# Altium schematic sheet Mod_Igloo_v1.SchDoc
size A4
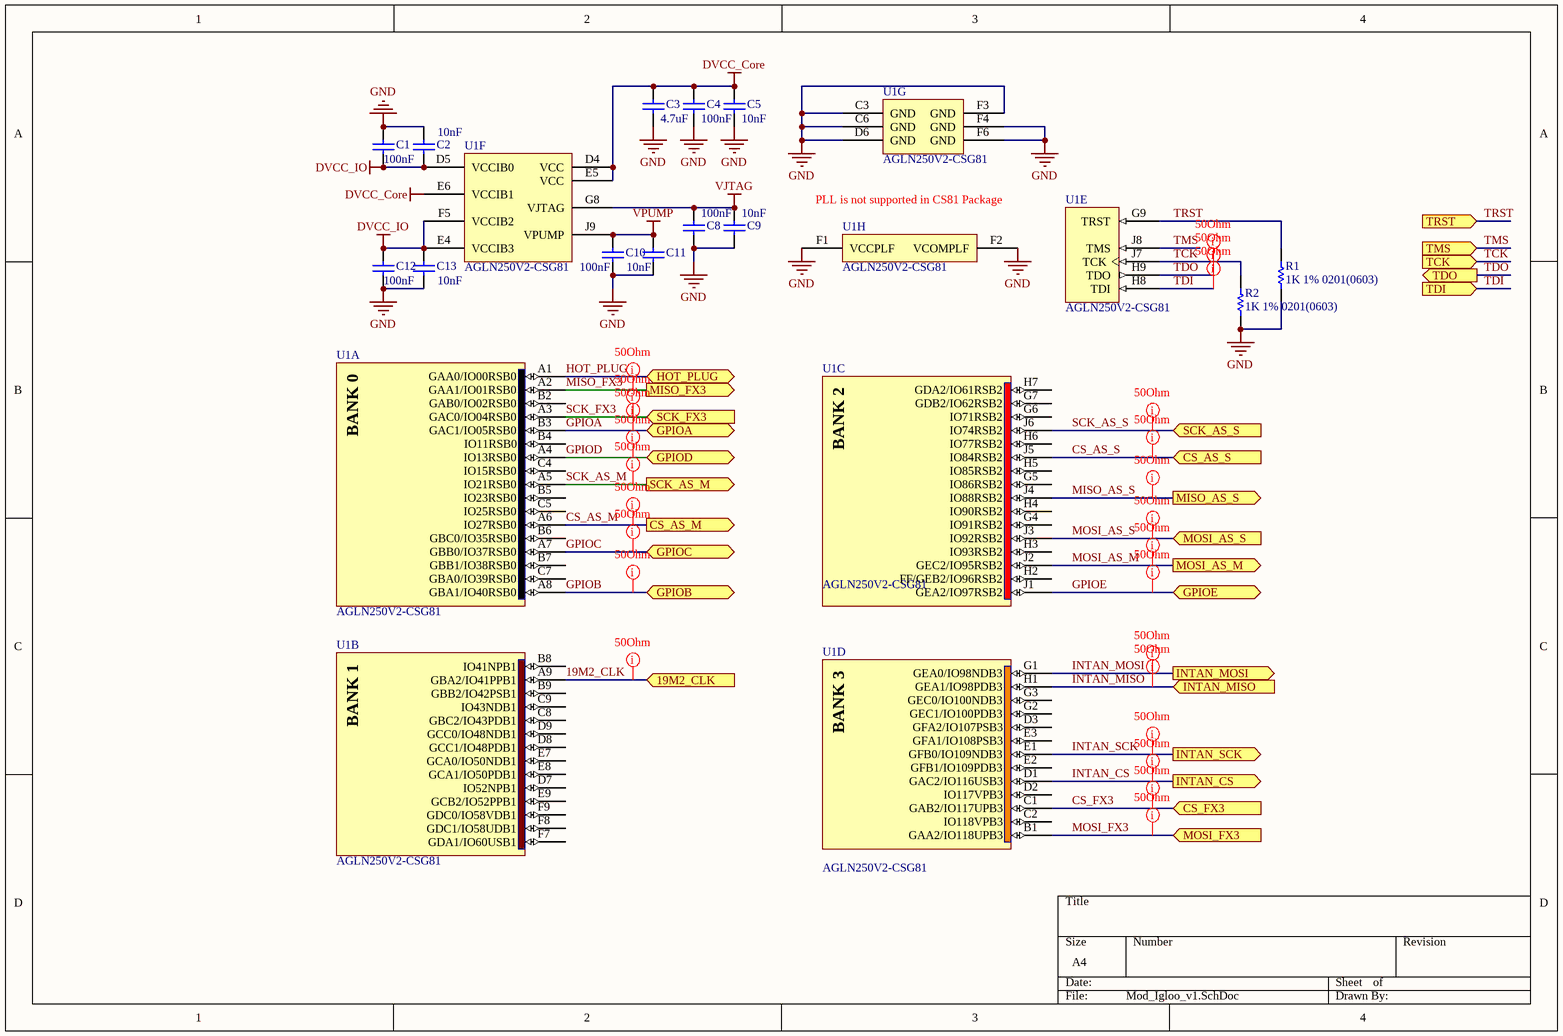
[diagram p0: Mod_Igloo_v1.SchDoc]

## Parts
(Parts that share a designator on the sheet are numbered #1, #2 ... from top to bottom, then left to right.)
C1  value 100nF  [CAPC0201(0603)33_N]  (hidden comment: CAP 100nF 16V 0201(0603))
C2  value 10nF  [CAPC0201(0603)33_L]  (hidden comment: CAP 10nF 16V 0201(0603))
C3  value 4.7uF  [CAPC0402(1005)60_N]  (hidden comment: CAP 4.7uF 6.3V 0402(1005))
C4  value 100nF  [CAPC0201(0603)33_N]  (hidden comment: CAP 100nF 16V 0201(0603))
C5  value 10nF  [CAPC0201(0603)33_L]  (hidden comment: CAP 10nF 16V 0201(0603))
C8  value 100nF  [CAPC0201(0603)33_N]  (hidden comment: CAP 100nF 16V 0201(0603))
C9  value 10nF  [CAPC0201(0603)33_L]  (hidden comment: CAP 10nF 16V 0201(0603))
C10  value 100nF  [CAPC0201(0603)33_N]  (hidden comment: CAP 100nF 16V 0201(0603))
C11  value 10nF  [CAPC0201(0603)33_L]  (hidden comment: CAP 10nF 16V 0201(0603))
C12  value 100nF  [CAPC0201(0603)33_N]  (hidden comment: CAP 100nF 16V 0201(0603))
C13  value 10nF  [CAPC0201(0603)33_L]  (hidden comment: CAP 10nF 16V 0201(0603))
R1  1K 1% 0201(0603)  [RESC0201(0603)_L]
R2  1K 1% 0201(0603)  [RESC0201(0603)_L]
U1#1  AGLN250V2-CSG81  [CS81]  (parts C,D,E of 8)
U1#2  AGLN250V2-CSG81  [CS81]  (parts A,B,F,G,H of 8)

## Ports
19M2_CLK (in), CS_AS_M (out), CS_AS_S (in), CS_FX3 (in), GPIOA, GPIOB, GPIOC, GPIOD, GPIOE, HOT_PLUG, INTAN_CS (out), INTAN_MISO (in), INTAN_MOSI (out), INTAN_SCK (out), MISO_AS_S (out), MISO_FX3 (out), MOSI_AS_M (out), MOSI_AS_S (in), MOSI_FX3 (in), SCK_AS_M (out), SCK_AS_S (in), SCK_FX3 (in), TCK (in), TDI (in), TDO (out), TMS (in), TRST (in)

## Nets
DVCC_Core: C3.1 C4.2 C5.2 U1#2.D4(VCC) U1#2.E5(VCC) U1#2.E6(VCCIB1)
DVCC_IO: C1.1 C2.1 C12.2 C13.1 U1#2.D5(VCCIB0) U1#2.E4(VCCIB3) U1#2.F5(VCCIB2)
GND: C1.2 C2.2 C3.2 C4.1 C5.1 C8.1 C9.1 C10.1 C11.1 C12.1 C13.2 R1.2 R2.2 U1#2.C3(GND) U1#2.C6(GND) U1#2.D6(GND) U1#2.F1(VCCPLF) U1#2.F2(VCOMPLF) U1#2.F3(GND) U1#2.F4(GND) U1#2.F6(GND)
VJTAG: C8.2 C9.2 U1#2.G8(VJTAG)
VPUMP: C10.2 C11.2 U1#2.J9(VPUMP)
19M2_CLK: U1#2.A9(GBA2/IO41PPB1) ; port 19M2_CLK
CS_AS_M: U1#2.A6(IO27RSB0) ; port CS_AS_M
CS_AS_S: U1#1.J5(IO84RSB2) ; port CS_AS_S
CS_FX3: U1#1.C1(GAB2/IO117UPB3) ; port CS_FX3
GPIOA: U1#2.B3(GAC1/IO05RSB0) ; port GPIOA
GPIOB: U1#2.A8(GBA1/IO40RSB0) ; port GPIOB
GPIOC: U1#2.A7(GBB0/IO37RSB0) ; port GPIOC
GPIOD: U1#2.A4(IO13RSB0) ; port GPIOD
GPIOE: U1#1.J1(GEA2/IO97RSB2) ; port GPIOE
HOT_PLUG: U1#2.A1(GAA0/IO00RSB0) ; port HOT_PLUG
INTAN_CS: U1#1.D1(GAC2/IO116USB3) ; port INTAN_CS
INTAN_MISO: U1#1.H1(GEA1/IO98PDB3) ; port INTAN_MISO
INTAN_MOSI: U1#1.G1(GEA0/IO98NDB3) ; port INTAN_MOSI
INTAN_SCK: U1#1.E1(GFB0/IO109NDB3) ; port INTAN_SCK
MISO_AS_S: U1#1.J4(IO88RSB2) ; port MISO_AS_S
MISO_FX3: U1#2.A2(GAA1/IO01RSB0) ; port MISO_FX3
MOSI_AS_M: U1#1.J2(GEC2/IO95RSB2) ; port MOSI_AS_M
MOSI_AS_S: U1#1.J3(IO92RSB2) ; port MOSI_AS_S
MOSI_FX3: U1#1.B1(GAA2/IO118UPB3) ; port MOSI_FX3
SCK_AS_M: U1#2.A5(IO21RSB0) ; port SCK_AS_M
SCK_AS_S: U1#1.J6(IO74RSB2) ; port SCK_AS_S
SCK_FX3: U1#2.A3(GAC0/IO04RSB0) ; port SCK_FX3
TCK: R2.1 U1#1.J7(TCK) ; port TCK
TDI: U1#1.H8(TDI) ; port TDI
TDO: U1#1.H9(TDO) ; port TDO
TMS: U1#1.J8(TMS) ; port TMS
TRST: R1.1 U1#1.G9(TRST) ; port TRST

Not connected (* = marked no-connect by the designer): U1#1 C2(IO118VPB3) D2(IO117VPB3) D3(GFA2/IO107PSB3) E2(GFB1/IO109PDB3) E3(GFA1/IO108PSB3) G2(GEC1/IO100PDB3) G3(GEC0/IO100NDB3) G4(IO91RSB2) G5(IO86RSB2) G6(IO71RSB2) G7(GDB2/IO62RSB2) H2(FF/GEB2/IO96RSB2) H3(IO93RSB2) H4(IO90RSB2) H5(IO85RSB2) H6(IO77RSB2) H7(GDA2/IO61RSB2); U1#2 B2(GAB0/IO02RSB0) B4(IO11RSB0) B5(IO23RSB0) B6(GBC0/IO35RSB0) B7(GBB1/IO38RSB0) B8(IO41NPB1) B9(GBB2/IO42PSB1) C4(IO15RSB0) C5(IO25RSB0) C7(GBA0/IO39RSB0) C8(GBC2/IO43PDB1) C9(IO43NDB1) D7(IO52NPB1) D8(GCC1/IO48PDB1) D9(GCC0/IO48NDB1) E7(GCA0/IO50NDB1) E8(GCA1/IO50PDB1) E9(GCB2/IO52PPB1) F7(GDA1/IO60USB1) F8(GDC1/IO58UDB1) F9(GDC0/IO58VDB1)

## Layout directives
net class 50Ohm: 19M2_CLK, CS_AS_M, CS_AS_S, CS_FX3, GPIOA, GPIOB, GPIOC, GPIOD, GPIOE, INTAN_CS, INTAN_MISO, INTAN_MOSI, INTAN_SCK, MISO_AS_S, MISO_FX3, MOSI_AS_M, MOSI_AS_S, MOSI_FX3, SCK_AS_M, SCK_AS_S, SCK_FX3, TCK, TDI, TDO

## Notes on the sheet
- (near U1#2) PLL is not supported in CS81 Package
- (in symbol CMP-0101-00037-1, part A) BANK 0
- (in symbol CMP-0101-00037-1, part B) BANK 1
- (in symbol CMP-0101-00037-1, part C) BANK 2
- (in symbol CMP-0101-00037-1, part D) BANK 3

## Library data of the parts
C1 C4 C8 C10 C12 = CMP-1033-00663-1: CAP 100nF 16V Â±10% 0201 (0603 Metric) Thickness 0.33mm SMD; Case-Metric: 0603; Case-EIA: 0201; Rated Voltage: 16 V; Max Thickness: 0.33 mm; Tolerance: Â±10%; Technology: SMT
C2 C5 C9 C11 C13 = CMP-1033-00642-1: CAP 10nF 16V Â±10% 0201 (0603 Metric) Thickness 0.33mm SMD; Case-Metric: 0603; Case-EIA: 0201; Technology: SMT; Tolerance: Â±10%; Max Thickness: 0.33 mm; Rated Voltage: 16 V
C3 = CMP-1034-02137-1: CAP 4.7uF 6.3V Â±20% 0402 (1005 Metric) Thickness 0.6mm SMD; Case-Metric: 1005; Case-EIA: 0402; Technology: SMT; Max Thickness: 0.6 mm; Tolerance: Â±20%; Rated Voltage: 6.3 V
R1 R2 = CMP-1010-00416-1: 1K 0.05W 1% 0201 (0603 Metric)  SMD; Value: 1000.00 Ohm; Case-Metric: 0603; Case-EIA: 0201; Technology: SMT; Tolerance: 1 %; Power: 0.05 W
U1#1 U1#2 = CMP-0101-00037-1: IGLOO nano Low-Power Flash 1.2 to 1.5V FPGA with Flash*Freeze, 60 User IOs, 250K System Gates, 1Kbit Flash ROM, 81-Pin CSP, Commercial Grade, Pb-Free; PackageVersion: ver11.2, Nov-2009; PackageReference: CS81; PackageDescription: 81-Ball Chip Scale Ball Grid Array 0.5 mm Pitch (CS81); Code_JEDEC: MO-195-AB; DatasheetVersion: v0.8, Jan-2010